# EasyEDA Pro project ProPrj_STM32F103ZET6_2025-04-15.epro, schematic Schematic1
Board Name: Board1; Create Date: 2025-03-15; Page Name: P1; Project Name: STM32F103ZET6; Schematic Name: Schematic1; Update Date: 2025-03-17; Company: 嘉立创EDA; Page Size: A4; Version: V1.0
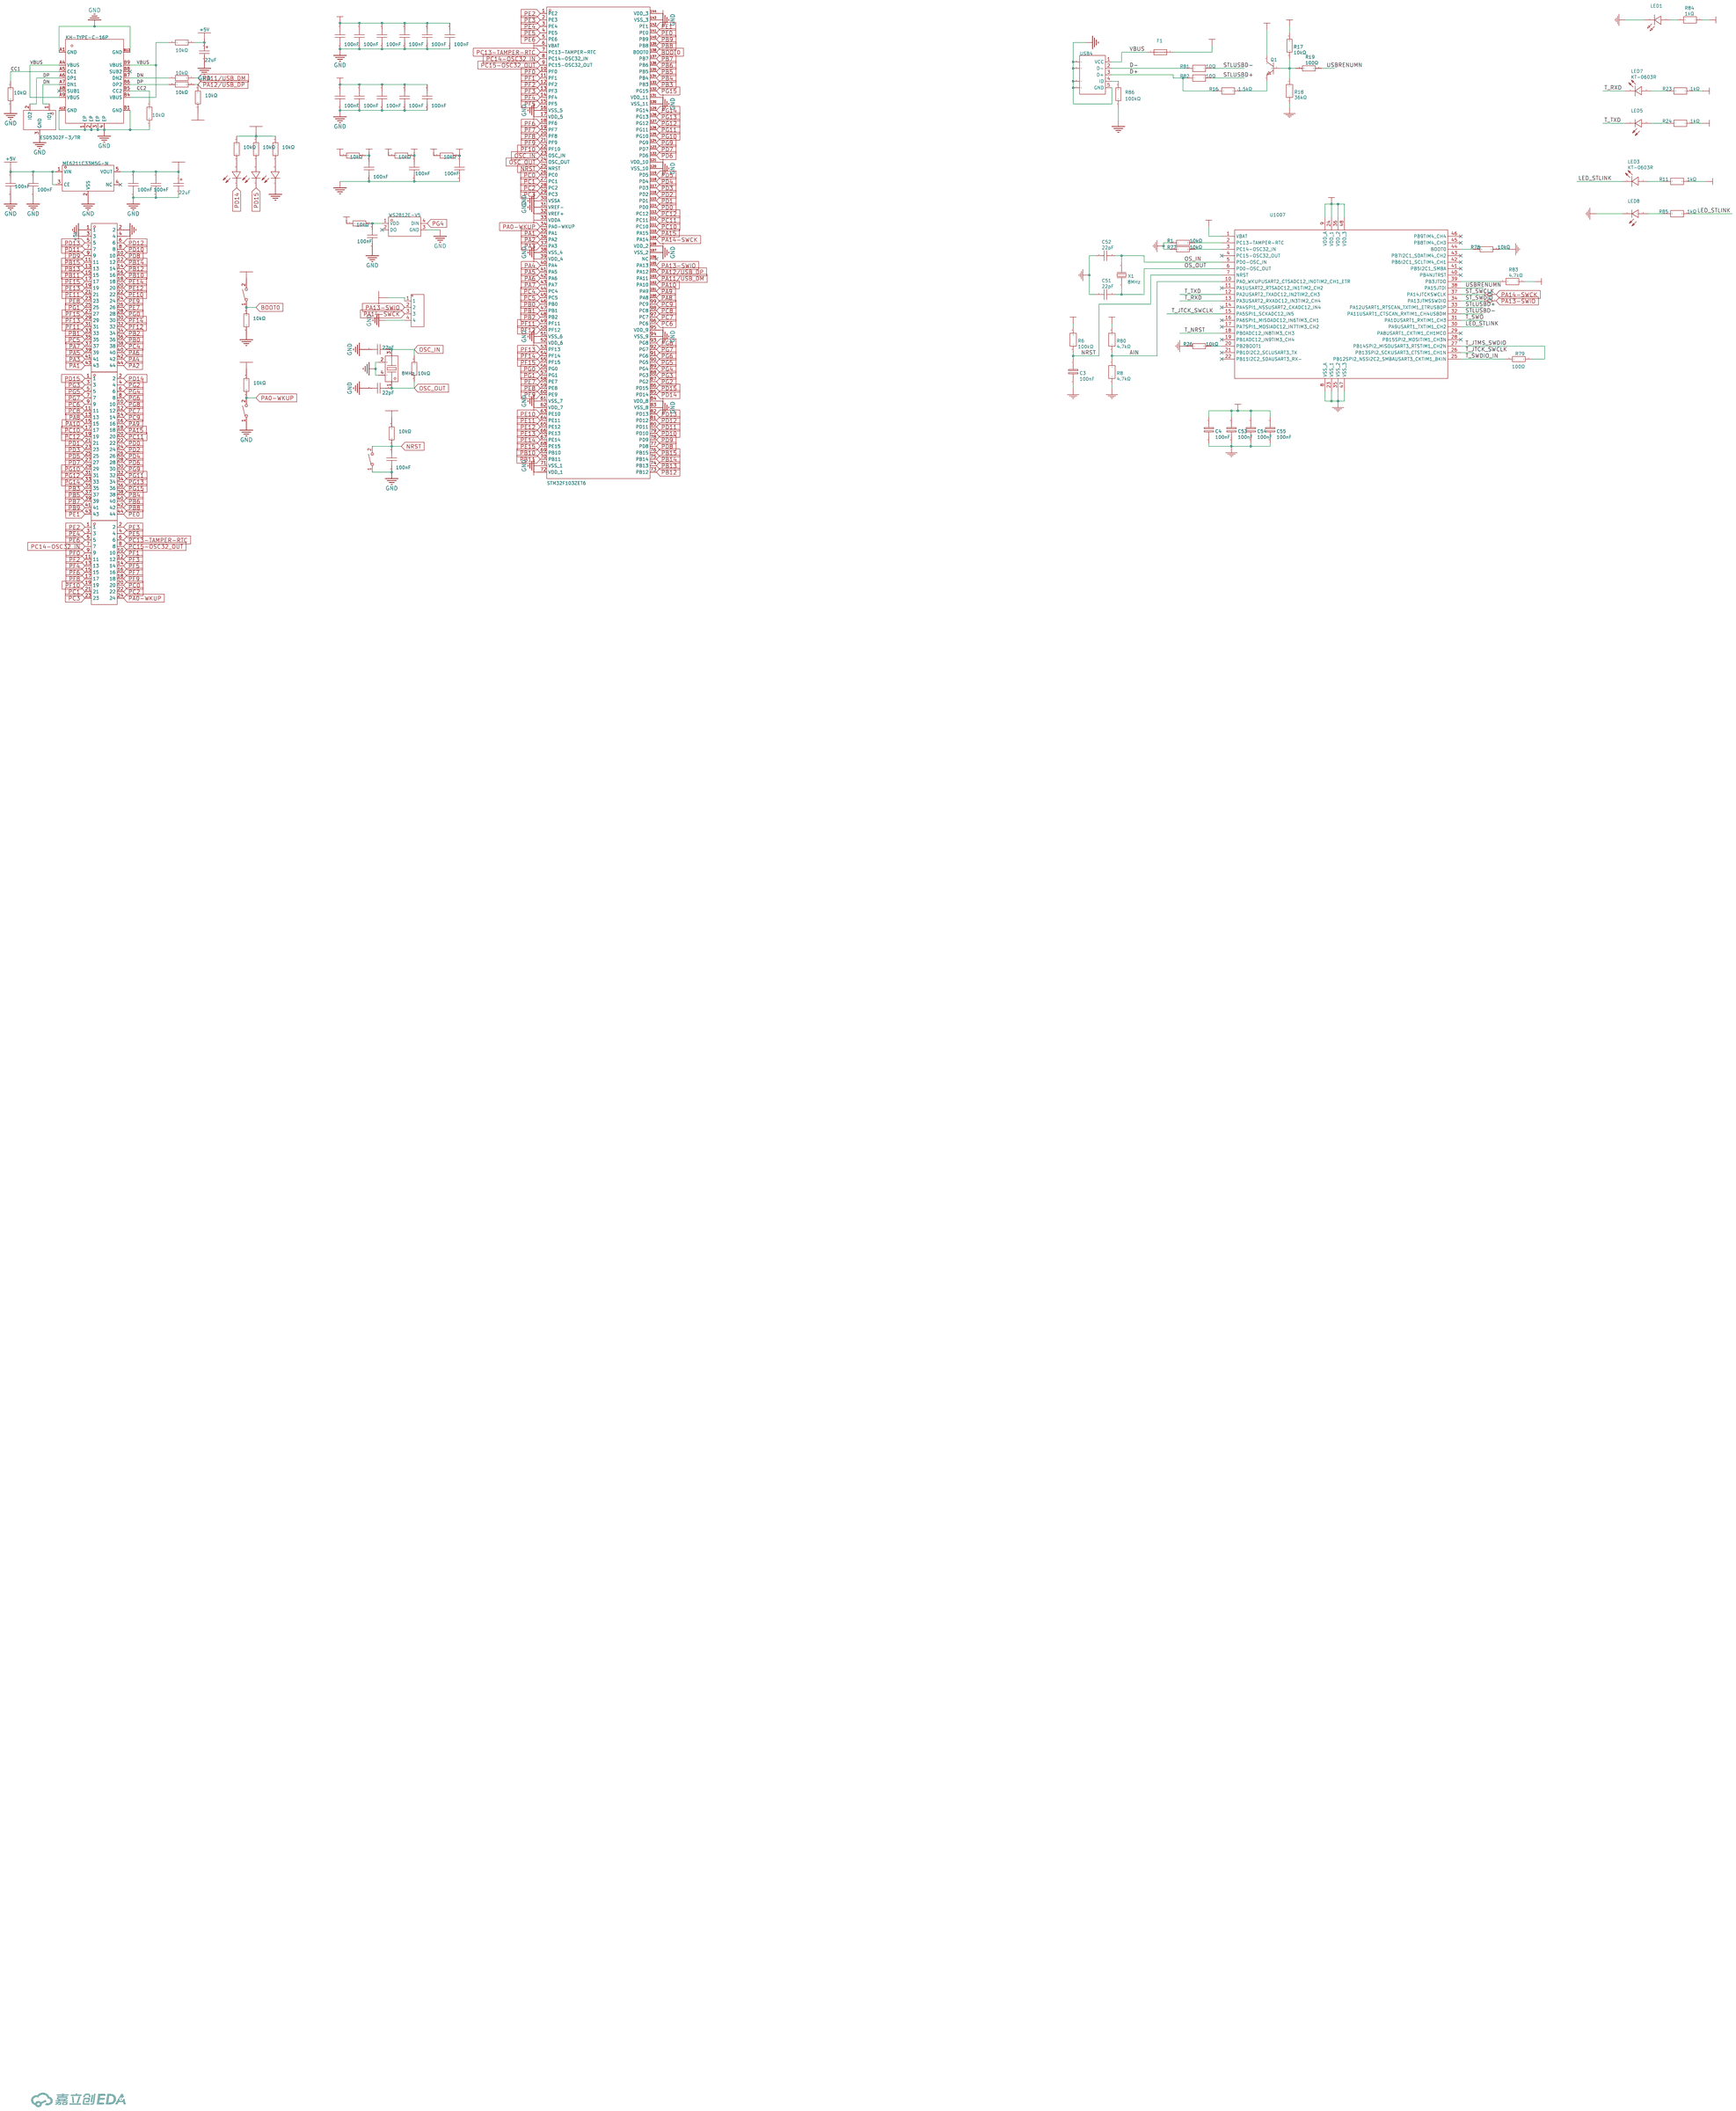
[diagram p0: schematic sheet]

## Parts
C1  22pF  [C0402]
C2  22pF  [C0402]
C3  100nF  [C0603]
C4  100nF  [C0603]
C5  100nF  [C0402]
C6  100nF  [C0402]
C7  100nF  [C0402]
C12  100nF  [C0402]
C13  100nF  [C0402]
C26  100nF  [C0402]
C27  100nF  [C0402]
C28  100nF  [C0402]
C29  100nF  [C0402]
C30  100nF  [C0402]
C31  100nF  [C0402]
C32  100nF  [C0402]
C33  100nF  [C0402]
C39  100nF  [C0402]
C42  22uF  [CASE-A_3216]
C43  22uF  [CASE-A_3216]
C44  100nF  [C0402]
C45  100nF  [C0402]
C46  100nF  [C0402]
C47  100nF  [C0402]
C48  100nF  [C0402]
C50  100nF  [C0402]
C51  22pF  [C0603]
C52  22pF  [C0603]
C53  100nF  [C0603]
C54  100nF  [C0603]
C55  100nF  [C0603]
D1  ESD5302F-3/TR  [SOT-23-3_L2.9-W1.3-P1.90-LS2.4-BR]
F1  TLC-NSMD100  [F1206]
H12  PZ254V-12-24P  [HDR-TH_24P-P2.54-V-M-R2-C12-S2.54]
H13  X6521WV-2x22H-C60D30  [HDR-TH_44P-2.54-V-M-R2-C22-S2.54]
H14  X6521WV-2x22H-C60D30  [HDR-TH_44P-2.54-V-M-R2-C22-S2.54]
LDO3  ME6211C33M5G-N  [SOT-23-5_L3.0-W1.7-P0.95-LS2.8-BL]
LED1  19-217/BHC-ZL1M2RY/3T  [LED0603-FD_BLUE]
LED3  KT-0603R  [LED0603-RD]
LED4  WS2812E-V5  [LED-SMD_4P-L5.0-W5.0-LS5.4-TL-1]
LED5  NCD0603G1  [LED0603-RD_1]
LED7  KT-0603R  [LED0603-RD]
LED8  NCD0603G1  [LED0603-RD_1]
Q1  M8050  [SOT-23-3_L2.9-W1.3-P1.90-LS2.4-BR]
R1  10kΩ  [R0603]
R2  10kΩ  [R0402]
R3  10kΩ  [R0402]
R4  10kΩ  [R0402]
R5  10kΩ  [R0402]
R6  100kΩ  [R0603]
R7  10kΩ  [R0402]
R8  4.7kΩ  [R0603]
R11  1kΩ  [R0603]
R12  10kΩ  [R0402]
R13  10kΩ  [R0402]
R14  10kΩ  [R0402]
R15  10kΩ  [R0402]
R16  1.5kΩ  [R0603]
R17  10kΩ  [R0603]
R18  36kΩ  [R0603]
R19  100Ω  [R0603]
R23  1kΩ  [R0603]
R24  1kΩ  [R0603]
R26  10kΩ  [R0603]
R45  10kΩ  [R0402]
R46  10kΩ  [R0402]
R48  10kΩ  [R0402]
R63  10kΩ  [R0402]
R66  10kΩ  [R0402]
R71  10kΩ  [R0402]
R73  10kΩ  [R0402]
R76  10kΩ  [R0402]
R77  10kΩ  [R0603]
R78  10kΩ  [R0603]
R79  100Ω  [R0603]
R80  4.7kΩ  [R0603]
R81  10Ω  [R0603]
R82  10Ω  [R0603]
R83  4.7kΩ  [R0603]
R84  1kΩ  [R0603]
R85  1kΩ  [R0603]
R86  100kΩ  [R0603]
SW3  TS342A2P-WZ  [SW-SMD_L4.0-W2.9-LS5.0]
SW5  TS342A2P-WZ  [SW-SMD_L4.0-W2.9-LS5.0]
SW6  TS342A2P-WZ  [SW-SMD_L4.0-W2.9-LS5.0]
U1  -  [LED0603-RD_GREEN]
U2  -  [HDR4P]
U3  -  [LED0603-RD_GREEN]
U1004  -  [LED0603-RD_GREEN]
U1006  STM32F103ZET6  [LQFP-144_L20.0-W20.0-P0.50-LS22.0-BL]
U1007  STM32F103CBT6  [LQFP-48_L7.0-W7.0-P0.50-LS9.0-BL]
USB3  KH-TYPE-C-16P  [USB-C-SMD_KH-TYPE-C-16P]
USB4  MINI 5PTP  [MINI-USB-SMD_MINI-5PTP]
X1  8MHz  [OSC-SMD_L5.0-W3.2]
X2  8MHz  [CRYSTAL-SMD_4P-L3.2-W2.5-BL]

## Library data of the parts
C1 C2 = CC0402JRNPO9BN220: 容值:22pF;精度:±5%;额定电压:50V;材质(温度系数):NP0;; LCSC Part Name: 22pF ±5% 50V; Supplier Part: C106203; Manufacturer: YAGEO(国巨); Supplier Footprint: 0402; JLCPCB Part Class: Extended Part; Datasheet: https://atta.szlcsc.com/upload/public/pdf/source/20170505/1493957838062.pdf; Supplier: LCSC; Tolerance: ±5%; Voltage Rated: 50V; Temperature Coefficient: NP0
C3 C4 C53-C55 = AC0603KRX7R9BB104: 容值:100nF;精度:±10%;额定电压:50V;材质(温度系数):X7R;; LCSC Part Name: 100nF ±10% 50V; Supplier Part: C149620; Manufacturer: YAGEO(国巨); Supplier Footprint: 0603; JLCPCB Part Class: Extended Part; Datasheet: https://atta.szlcsc.com/upload/public/pdf/source/20180620/C149620_02F8B13B41E85E9B7C614DEEBBCCF362.pdf; Supplier: LCSC; Tolerance: ±10%; Voltage Rated: 50V; Temperature Coefficient: X7R
C5-C7 C12 C13 C28-C33 C39 C44-C48 C50 = GRM155R71H104KE14D: 容值:100nF;精度:±10%;额定电压:50V;材质(温度系数):X7R;; LCSC Part Name: 100nF ±10% 50V; Supplier Part: C77020; Manufacturer: muRata(村田); Supplier Footprint: 0402; JLCPCB Part Class: Extended Part; Datasheet: https://atta.szlcsc.com/upload/public/pdf/source/20180326/C77020_39BD49C951FF1AF0DB1F1FAC5AC1E401.pdf; Supplier: LCSC; Tolerance: ±10%; Voltage Rated: 50V; Temperature Coefficient: X7R
C26 C27 = GCM155R71C104KA55J: 容值:100nF;精度:±10%;额定电压:16V;材质(温度系数):X7R;; LCSC Part Name: 100nF ±10% 16V; Supplier Part: C2655418; Manufacturer: muRata(村田); Supplier Footprint: 0402; JLCPCB Part Class: Extended Part; Datasheet: https://atta.szlcsc.com/upload/public/pdf/source/20210701/42090801FDE37D0E45AFF657247F4A08.pdf; Supplier: LCSC; Tolerance: ±10%; Voltage Rated: 16V; Temperature Coefficient: X7R
C42 C43 = TAJA226K010RNJ: 容值:22uF;精度:±10%;额定电压:10V;等效串联电阻:3Ω@100kHz;; LCSC Part Name: 22uF ±10% 10V; Supplier Part: C11366; Manufacturer: Kyocera AVX; Supplier Footprint: CASE-A-3216; JLCPCB Part Class: 扩展库; Datasheet: https://atta.szlcsc.com/upload/public/pdf/source/20160107/1457707750344.pdf; Supplier: LCSC; Tolerance: ±10%; Rated Voltage: 10V; Equivalent Series Resistance(ESR): 3Ω@100kHz; Operating Temperature: -55℃~+125℃
C51 C52 = CL10C220JB8NNNC: 容值:22pF;精度:±5%;额定电压:50V;材质(温度系数):C0G;; LCSC Part Name: 22pF ±5% 50V; Supplier Part: C1653; Manufacturer: SAMSUNG(三星); Supplier Footprint: 0603; JLCPCB Part Class: Basic Part; Datasheet: https://atta.szlcsc.com/upload/public/pdf/source/20160218/1457707763339.pdf; Supplier: LCSC; Tolerance: ±5%; Voltage Rated: 50V; Temperature Coefficient: C0G
D1 = ESD5302F-3/TR: 反向截止电压(Vrwm):5V;钳位电压:20V;峰值脉冲电流(Ipp):16A;击穿电压:7V;; Supplier Part: C239643; Manufacturer: WILLSEMI(韦尔); Supplier Footprint: SOT-23; JLCPCB Part Class: Extended Part; Datasheet: https://atta.szlcsc.com/upload/public/pdf/source/20191209/C239643_5B865DE0A7A05DEAA50437ED66DC6932.pdf; Supplier: LCSC; Polarity: 单向; Reverse Stand-Off Voltage (Vrwm): 5V; Breakdown Voltage (Min): 7V; Peak Pulse Current (Ipp)@10/1000μs: 16A; Maximum Clamping Voltage: 20V; Clamping Voltage: 20V; Peak Pulse Current (Ipp): 16A; Voltage - Breakdown: 7V; Type: TVS
F1 = TLC-NSMD100: 耐压:6V;最大电流:100A;保持电流(Ih):1A;跳闸电流:2A;; LCSC Part Name: 6V 1A 1206自恢复; Supplier Part: C261954; Manufacturer: TLC(竞沃); Supplier Footprint: 1206; JLCPCB Part Class: Extended Part; Datasheet: https://atta.szlcsc.com/upload/public/pdf/source/20180802/C261957_E25258C63D2572D4B5DAC4246B729F01.pdf; Supplier: LCSC; Voltage - Max: 6V; Current - Max: 100A; Hold Current: 1A; Trip Current: 2A; Power Dissipation: 600mW; Time to Trip(Max): 100ms; Operating Temperature: -40℃~+85℃
H12 = PZ254V-12-24P: 插针结构:2x12P;间距:2.54mm;行距:2.54mm;圆针/方针:方针;安装类型:直插;排数:双排;总PIN位数:24P;额定电流:-;额定电压:-;配合针长度:6mm;塑高:2.5mm;端接针长度:3mm;触头材质:黄铜;触头镀层:-;工作温度范围:-40℃~+105℃;颜色:黑色;; LCSC Part Name: 间距:2.54mm 2x12P 直插 方针; Supplier Part: C492429; Manufacturer: XFCN(兴飞); Supplier Footprint: 插件,P=2.54mm; JLCPCB Part Class: 扩展库; Datasheet: https://atta.szlcsc.com/upload/public/pdf/source/20200309/C492429_A90DEF30FD4D9CDC2C3DDFC5EAF9C00B.pdf; Supplier: LCSC; Pin Structure: 2x12P; Pitch: 2.54mm; Row Spacing: 2.54mm; Circluar Pins/Square Pins: 方针; Mounting Type: 直插; Number of Rows: 双排; Number of Pins: 24P; Length of Mating Pin: 6mm; Insulation Height: 2.5mm; Length of End Connection Pin: 3mm; Contact Material: 黄铜; Operating Temperature Range: -40℃~+105℃; Color: 黑色
H13 H14 = X6521WV-2x22H-C60D30: 插针结构:2x22P;间距:2.54mm;行距:2.54mm;圆针/方针:方针;安装类型:-;排数:双排;总PIN位数:44P;额定电流:3A;额定电压:250V;配合针长度:6mm;塑高:2.5mm;端接针长度:3mm;触头材质:黄铜;触头镀层:金;工作温度范围:-40℃~+105℃;焊接温度(最大值):260℃;颜色:黑色;; LCSC Part Name: 2x22P 间距:2.54mm 方针; Supplier Part: C725894; Manufacturer: XKB Connection(中国星坤); Supplier Footprint: 插件,P=2.54mm; JLCPCB Part Class: 扩展库; Datasheet: https://atta.szlcsc.com/upload/public/pdf/source/20230515/3562B41AC32B1731F21EFD73DC35CC6C.pdf; Supplier: LCSC; Pin Structure: 2x22P; Pitch: 2.54mm; Row Spacing: 2.54mm; Circluar Pins/Square Pins: 方针; Number of Rows: 双排; Number of Pins: 44P; Current Rating (Max): 3A; Voltage Rating (Max): 250V; Length of Mating Pin: 6mm; Insulation Height: 2.5mm; Length of End Connection Pin: 3mm; Contact Material: 黄铜; Contact Plating: 金; Operating Temperature Range: -40℃~+105℃; Soldering Temperature(Max): 260℃; Color: 黑色
LDO3 = ME6211C33M5G-N: 输出类型:固定;工作电压:6V;输出电压:3.3V;输出电流:500mA;电源纹波抑制比(PSRR):70dB@(1kHz)；62dB@(10kHz);输出极性:正极;; LCSC Part Name: 输入6V 输出3.3V 500mA; Supplier Part: C82942; Manufacturer: MICRONE(南京微盟); Supplier Footprint: SOT-23-5; JLCPCB Part Class: Extended Part; Datasheet: https://atta.szlcsc.com/upload/public/pdf/source/20170918/C82942_1505727073070976520.pdf; Supplier: LCSC; Output Type: 固定; Voltage - Supply: 6V; Output Voltage: 3.3V; Output Current: 500mA; Power Supply Rejection Ratio (PSRR): 70dB@(1kHz)；62dB@(10kHz); Voltage Dropout: 260mV@(200mA); Features: 短路保护(SCP)；低ESR；过流保护(OCP)；带使能; Output Configuration: 正极; Number of Outputs: 1
LED1 = 19-217/BHC-ZL1M2RY/3T: 发光颜色:蓝色;功率:110mW;正向电流:5mA;主波长:465nm~475nm;二极管配置:-;透镜颜色:无色透明透镜;色温:-;发光角度:120°;载带方式:-;工作温度:-40℃~+85℃;; LCSC Part Name: 蓝灯 停产; Supplier Part: C72041; Manufacturer: EVERLIGHT(亿光); Supplier Footprint: 0603; JLCPCB Part Class: Extended Part; Datasheet: https://atta.szlcsc.com/upload/public/pdf/source/20170116/1484561237273.pdf; Supplier: LCSC; Emitted Color: 蓝色; Power Dissipation: 110mW; Forward Current: 5mA; Dominant Wavelength: 465nm~475nm; Peak Wavelength: 468nm; Lens Color: 无色透明透镜; Viewing Angle: 120°; Operating Temperature: -40℃~+85℃
LED3 LED7 = KT-0603R: Supplier: LCSC; Manufacturer: KENTO; Supplier Part: C2286; JLCPCB Part Class: Basic Part
LED4 = WS2812E-V5: 发光颜色:RGB三色;二极管配置:-;透镜颜色:-;主波长:623nm；451nm；523nm;峰值波长:-;色温:-;测试电流:12.5mA;功率:-;发光角度:-;安装方式:-;工作温度:-;; LCSC Part Name: RGB三色623nm451nm523nm（注意防潮，请查阅规格书中对应具体内容）; Supplier Part: C2920042; Manufacturer: worldsemi; Supplier Footprint: SMD5050; JLCPCB Part Class: 扩展库; Datasheet: https://atta.szlcsc.com/upload/public/pdf/source/20211117/0464A411C41E6FA3BF6C3A8020ED01CE.pdf; Supplier: LCSC; Emitted Color: RGB三色; Dominant Wavelength: 623nm；451nm；523nm; Forward Current: 12.5mA
LED5 LED8 = NCD0603G1: 发光颜色:翠绿色;正向电压(VF):2.6V~3.6V;功率:72mW;正向电流:10mA;主波长:515nm~530nm;透镜颜色:无色透明透镜;发光强度:330mcd~900mcd;发光角度:130°;工作温度:-30℃~+85℃;; Supplier Part: C84267; Manufacturer: 国星光电; Supplier Footprint: 0603; JLCPCB Part Class: Extended Part; Datasheet: https://atta.szlcsc.com/upload/public/pdf/source/20200820/C84267_04BA7703640BAC111D09F5EFB971FBF3.pdf; Supplier: LCSC; Emitted Color: 翠绿色; Forward Voltage (VF): 2.6V~3.6V; Power Dissipation: 72mW; Forward Current: 10mA; Dominant Wavelength: 515nm~530nm; Lens Color: 无色透明透镜; Luminous Intensity: 330mcd~900mcd; Viewing Angle: 130°; Operating Temperature: -30℃~+85℃
Q1 = M8050_C266599: 晶体管类型:NPN;集电极电流(Ic):800mA;集射极击穿电压(Vceo):25V;耗散功率(Pd):200mW;直流电流增益(hFE):45@5mA,1V;; Supplier Part: C266599; Manufacturer: BORN(伯恩半导体); Supplier Footprint: SOT-23; JLCPCB Part Class: Extended Part; Datasheet: https://atta.szlcsc.com/upload/public/pdf/source/20190325/C266599_C3D99E625B293D75672D2862955AF640.pdf; Supplier: LCSC; type: NPN; Current - Collector(Ic): 800mA; Collector - Emitter Voltage VCEO: 25V; Pd - Power Dissipation: 200mW; DC Current Gain: 45@5mA,1V; Transition frequency(fT): 150MHz; Current - Collector Cutoff: 100nA; Vce Saturation(VCE(sat)): 500mV; Operating Temperature: -55℃~+150℃
R1 R17 R26 R77 R78 = AC0603FR-0710KL: 电阻类型:厚膜电阻;阻值:10kΩ;精度:±1%;功率:100mW;最大工作电压:75V;温度系数:±100ppm/℃;; LCSC Part Name: 厚膜电阻 10kΩ ±1% 100mW; Supplier Part: C116677; Manufacturer: YAGEO(国巨); Supplier Footprint: 0603; JLCPCB Part Class: Extended Part; Datasheet: https://atta.szlcsc.com/upload/public/pdf/source/20180927/C229861_4ABDC471507C1ED6AFB4BA66AFC8620A.pdf; Supplier: LCSC; Type: 厚膜电阻; Tolerance: ±1%; Power(Watts): 100mW; Overload Voltage (Max): 75V; Temperature Coefficient: ±100ppm/℃; Operating Temperature Range: -55℃~+155℃
R2-R5 R7 R12-R15 R45 R46 R48 R63 R66 R71 R73 R76 = RC0402FR-0710KL: 电阻类型:厚膜电阻;阻值:10kΩ;精度:±1%;功率:62.5mW;最大工作电压:50V;温度系数:±100ppm/℃;; LCSC Part Name: 厚膜电阻 10kΩ ±1% 62.5mW; Supplier Part: C60490; Manufacturer: YAGEO(国巨); Supplier Footprint: 0402; JLCPCB Part Class: Extended Part; Datasheet: https://atta.szlcsc.com/upload/public/pdf/source/20170925/C131467_1506321478108990263.pdf; Supplier: LCSC; Type: 厚膜电阻; Tolerance: ±1%; Power(Watts): 62.5mW; Overload Voltage (Max): 50V; Temperature Coefficient: ±100ppm/℃; Operating Temperature Range: -55℃~+155℃
R6 = AC0603FR-07100KL: 电阻类型:厚膜电阻;阻值:100kΩ;精度:±1%;功率:100mW;最大工作电压:75V;温度系数:±100ppm/℃;; LCSC Part Name: 厚膜电阻 100kΩ ±1% 100mW; Supplier Part: C116674; Manufacturer: YAGEO(国巨); Supplier Footprint: 0603; JLCPCB Part Class: Extended Part; Datasheet: https://atta.szlcsc.com/upload/public/pdf/source/20180927/C229861_4ABDC471507C1ED6AFB4BA66AFC8620A.pdf; Supplier: LCSC; Type: 厚膜电阻; Tolerance: ±1%; Power(Watts): 100mW; Overload Voltage (Max): 75V; Temperature Coefficient: ±100ppm/℃; Operating Temperature Range: -55℃~+155℃
R8 R80 R83 = AC0603FR-074K7L: 电阻类型:厚膜电阻;阻值:4.7kΩ;精度:±1%;功率:100mW;最大工作电压:75V;温度系数:±100ppm/℃;; LCSC Part Name: 厚膜电阻 4.7kΩ ±1% 100mW; Supplier Part: C116697; Manufacturer: YAGEO(国巨); Supplier Footprint: 0603; JLCPCB Part Class: Extended Part; Datasheet: https://atta.szlcsc.com/upload/public/pdf/source/20180927/C229861_4ABDC471507C1ED6AFB4BA66AFC8620A.pdf; Supplier: LCSC; Type: 厚膜电阻; Tolerance: ±1%; Power(Watts): 100mW; Overload Voltage (Max): 75V; Temperature Coefficient: ±100ppm/℃; Operating Temperature Range: -55℃~+155℃
R11 R23 R24 R84 R85 = RC0603FR-071KL: 电阻类型:厚膜电阻;阻值:1kΩ;精度:±1%;功率:100mW;最大工作电压:75V;温度系数:±100ppm/℃;; LCSC Part Name: 厚膜电阻 1kΩ ±1% 100mW; Supplier Part: C22548; Manufacturer: YAGEO(国巨); Supplier Footprint: 0603; JLCPCB Part Class: Extended Part; Datasheet: https://atta.szlcsc.com/upload/public/pdf/source/20180316/70C0E2BDAE7FCC62C531A5A58D202EE1.pdf; Supplier: LCSC; Type: 厚膜电阻; Tolerance: ±1%; Power(Watts): 100mW; Overload Voltage (Max): 75V; Temperature Coefficient: ±100ppm/℃; Operating Temperature Range: -55℃~+155℃
R16 = RC0603FR-071K5L: 电阻类型:厚膜电阻;阻值:1.5kΩ;精度:±1%;功率:100mW;最大工作电压:75V;温度系数:±100ppm/℃;; LCSC Part Name: 厚膜电阻 1.5kΩ ±1% 100mW; Supplier Part: C114668; Manufacturer: YAGEO(国巨); Supplier Footprint: 0603; JLCPCB Part Class: Extended Part; Datasheet: https://atta.szlcsc.com/upload/public/pdf/source/20180821/C275644_0D56F95EFF785E7D9A1FEF436B37DA78.pdf; Supplier: LCSC; Type: 厚膜电阻; Tolerance: ±1%; Power(Watts): 100mW; Overload Voltage (Max): 75V; Temperature Coefficient: ±100ppm/℃; Operating Temperature Range: -55℃~+155℃
R18 = AC0603FR-0736KL: 电阻类型:厚膜电阻;阻值:36kΩ;精度:±1%;功率:100mW;最大工作电压:75V;温度系数:±100ppm/℃;; LCSC Part Name: 厚膜电阻 36kΩ ±1% 100mW; Supplier Part: C227841; Manufacturer: YAGEO(国巨); Supplier Footprint: 0603; JLCPCB Part Class: Extended Part; Datasheet: https://atta.szlcsc.com/upload/public/pdf/source/20181022/C227841_96856283ED360952E7A28642F53DDE64.pdf; Supplier: LCSC; Type: 厚膜电阻; Tolerance: ±1%; Power(Watts): 100mW; Overload Voltage (Max): 75V; Temperature Coefficient: ±100ppm/℃; Operating Temperature Range: -55℃~+155℃
R19 R79 = RC0603FR-07100RL: 电阻类型:厚膜电阻;阻值:100Ω;精度:±1%;功率:100mW;最大工作电压:75V;温度系数:±100ppm/℃;; LCSC Part Name: 厚膜电阻 100Ω ±1% 100mW; Supplier Part: C105588; Manufacturer: YAGEO(国巨); Supplier Footprint: 0603; JLCPCB Part Class: Extended Part; Datasheet: https://atta.szlcsc.com/upload/public/pdf/source/20180316/70C0E2BDAE7FCC62C531A5A58D202EE1.pdf; Supplier: LCSC; Type: 厚膜电阻; Tolerance: ±1%; Power(Watts): 100mW; Overload Voltage (Max): 75V; Temperature Coefficient: ±100ppm/℃; Operating Temperature Range: -55℃~+155℃
R81 R82 = RC0603FR-0710RL: 电阻类型:厚膜电阻;阻值:10Ω;精度:±1%;功率:100mW;最大工作电压:75V;温度系数:±200ppm/℃;; LCSC Part Name: 厚膜电阻 10Ω ±1% 100mW; Supplier Part: C109318; Manufacturer: YAGEO(国巨); Supplier Footprint: 0603; JLCPCB Part Class: Extended Part; Datasheet: https://atta.szlcsc.com/upload/public/pdf/source/20180316/70C0E2BDAE7FCC62C531A5A58D202EE1.pdf; Supplier: LCSC; Type: 厚膜电阻; Tolerance: ±1%; Power(Watts): 100mW; Overload Voltage (Max): 75V; Temperature Coefficient: ±200ppm/℃; Operating Temperature Range: -55℃~+155℃
R86 = 0603WAF1003T5E: 电阻类型:厚膜电阻;阻值:100kΩ;精度:±1%;功率:100mW;最大工作电压:75V;温度系数:±100ppm/℃;; LCSC Part Name: 100kΩ ±1% 100mW 厚膜电阻; Supplier Part: C25803; Manufacturer: UNI-ROYAL(厚声); Supplier Footprint: 0603; JLCPCB Part Class: 基础库; Datasheet: https://atta.szlcsc.com/upload/public/pdf/source/20200306/C422600_1E6D84923E4A46A82E41ADD87F860B5C.pdf; Supplier: LCSC; Type: 厚膜电阻; Tolerance: ±1%; Power(Watts): 100mW; Overload Voltage (Max): 75V; Temperature Coefficient: ±100ppm/℃; Operating Temperature Range: -55℃~+155℃
SW3 SW5 SW6 = TS342A2P-WZ: 电路结构:单刀单掷;按钮形状:圆形按钮;安装方式:立贴;开关长度:3.95mm;开关宽度:2.9mm;开关高度:2mm;带支架:不带;触点电流:50mA;额定电压(DC):12V;绝缘电阻:100MΩ;机械寿命:3万次;; LCSC Part Name: 3.95*2.9*2mm 立贴 轻触开关; Supplier Part: C557591; Manufacturer: SHOU HAN(首韩); Supplier Footprint: SMD; JLCPCB Part Class: Extended Part; Datasheet: https://atta.szlcsc.com/upload/public/pdf/source/20200519/C557591_B3A5A21584733303F06306F18577DA8B.pdf; Supplier: LCSC; Contact Current: 50mA; Voltage Rating (DC): 12V; Insulation Resistance: 100MΩ; Circuit: 单刀单掷; Mounting Style: 立贴; Actuator Style: 圆形按钮; Actuator/Cap Color: 黑色; Mechanical Life: 3万次; Operating Temperature: -25℃~+70℃; Pin Style: SMD接片; Switch Length: 3.95mm; Switch Width: 2.9mm; Switch Height: 2mm; Strike Gundam: 不带
U1 U3 U1004 = 绿色LED0603: Supplier Part: C9900005570; Supplier Footprint: LED0603; JLCPCB Part Class: ExtendedPart; Supplier: LCSC
U2 = HDR4P
U1006 = STM32F103ZET6: CPU内核:ARM-M3;CPU最大主频:72MHz;; LCSC Part Name: 主流增强型ARM Cortex-M3 MCU，具有512 KB Flash、72 MHz CPU、电机控制、USB和CAN; Supplier Part: C8287; Manufacturer: ST(意法半导体); Supplier Footprint: LQFP-144(20x20); JLCPCB Part Class: 扩展库; Datasheet: https://atta.szlcsc.com/upload/public/pdf/source/20180327/C88435_0E51D69B5FFD7B1A3F36EB9FC047A4C2.pdf; Supplier: LCSC; CPU Core: ARM-M3; CPU Maximum Speed: 72MHz; Program Storage Size: 512KB; Program Memory Type: FLASH; Number of I/O: 112; ADC (Bit): 12bit; DAC (Bit): 12bit; Low Voltage Detection Threshold: 2V~3.6V; RAM Size: 64KB; GPIO Ports Number: 112; Operating Voltage Range: 2V~3.6V; Operating Temperature Range: -40℃~+85℃; Universal Serial Bus: 有; Peripheral/Function: DMA；片载温度传感器；PWM; Watchdog: 有; Infrared Data Association: 有; Low-Voltage Detect: 有; Direct Memory Access: 有; Internal Oscillator: 有
U1007 = STM32F103CBT6: CPU内核:ARM-M3;CPU最大主频:72MHz;应用领域:-;; LCSC Part Name: 主流增强型ARM Cortex-M3 MCU，具有128 KB Flash、72 MHz CPU、电机控制、USB和CAN; Supplier Part: C8304; Manufacturer: ST(意法半导体); Supplier Footprint: LQFP-48(7x7); JLCPCB Part Class: Extended Part; Datasheet: https://atta.szlcsc.com/upload/public/pdf/source/20150811/1457707344439.pdf; Supplier: LCSC; CPU Core: ARM-M3; CPU Maximum Speed: 72MHz; Program Storage Size: 128KB; Program Memory Type: FLASH; Number of I/O: 37; ADC (Bit): 12bit; Low Voltage Detection Threshold: 2V~3.6V
USB3 = KH-TYPE-C-16P: 连接器类型:Type-C;标准:-;公母:母座;触点数量:16;端口数量:1;安装方式:卧贴;额定电流 - 电源:3A;工作温度范围:-40℃~+85℃;; LCSC Part Name: Type-C母座卧贴; Supplier Part: C709357; Manufacturer: kinghelm(金航标); Supplier Footprint: SMD; JLCPCB Part Class: 扩展库; Datasheet: https://atta.szlcsc.com/upload/public/pdf/source/20200911/C709357_AA8DCEB38BB20E3035A7ED7AE7667837.pdf; Supplier: LCSC; Connector Type: Type-C; Gender: 母座; Number of Contacts: 16; Number of Ports: 1; Mounting Style: 卧贴; Current Rating - Power (Max): 3A; Operating Temperature Range: -40℃~+85℃
USB4 = MINI 5PTP: 连接器类型:Mini-B;标准:USB 2.0;公母:母;安装方式:卧贴;触点数量:5P;端口数量:1;额定电流 - 电源:1A;工作温度范围:-30℃~+80℃;; Supplier Part: C2681563; Manufacturer: SHOU HAN(首韩); Supplier Footprint: SMD; JLCPCB Part Class: 扩展库; Datasheet: https://atta.szlcsc.com/upload/public/pdf/source/20210122/C2681563_5D04D24BBA4C56EC4906A22CA4EB95CA.pdf; Supplier: LCSC; Connector Type: Mini-B; Standard: USB 2.0; Gender: 母; Mounting Style: 卧贴; Number of Contacts: 5P; Number of Ports: 1; Current Rating - Power (Max): 1A; Rated Voltage (Max): 30V; Connect-Disconnect Life: 3千次; Length: 9.3mm; Core Colour: 黑色; Operating Temperature Range: -30℃~+80℃
X1 = 7A08000008: 晶振类型:贴片晶振;频率:8MHz;常温频差:±30ppm;负载电容:20pF;; LCSC Part Name: 8MHz ±30ppm 20pF; Supplier Part: C111120; Manufacturer: TXC(晶技); Supplier Footprint: SMD5032; JLCPCB Part Class: Extended Part; Datasheet: https://atta.szlcsc.com/upload/public/pdf/source/20170624/1498276323594.pdf; Supplier: LCSC; Crystal Type: 贴片晶振; Normal temperature Frequency Tolerance: ±30ppm; Load Capacitance: 20pF; Equivalent Series Resistance (ESR): 80Ω; Operating Temperature: -10℃~+70℃
X2 = CJ13-080001210B20: 频率:8MHz;常温频差:±10ppm;负载电容:12pF;; LCSC Part Name: 8MHz ±10ppm 12pF; Supplier Part: C2875274; Manufacturer: CJ(江苏长电/长晶); Supplier Footprint: SMD3225-4P; JLCPCB Part Class: Extended Part; Datasheet: https://atta.szlcsc.com/upload/public/pdf/source/20210824/6E1F59D92CEEC2B7E10E0FA064B9C05B.pdf; Supplier: LCSC; Normal temperature Frequency Tolerance: ±10ppm; Load Capacitance: 12pF

## Nets
+3.3V: C4.1 C5.1 C6.1 C7.1 C12.1 C27.1 C28.1 C33.1 C43.1 C44.1 C45.1 C46.1 C47.1 C48.1 C50.1 C53.1 C54.1 C55.1 H14.4 LDO3.5(VOUT) Q1.3(C) R3.2 R4.2 R5.2 R6.2 R11.1 R23.1 R24.1 R45.2 R46.1 R66.2 R71.2 R73.1 R76.1 R80.2 R83.1 R84.1 SW6.2 U2.1 U1006.17(VDD_5) U1006.39(VDD_4) U1006.52(VDD_6) U1006.62(VDD_7) U1006.72(VDD_1) U1006.84(VDD_8) U1006.95(VDD_9) U1006.108(VDD_2) U1006.121(VDD_10) U1006.131(VDD_11) U1006.144(VDD_3) U1007.1(VBAT) U1007.9(VDD_A) U1007.24(VDD_1) U1007.36(VDD_2) U1007.48(VDD_3)
+5V: C26.1 C29.1 C42.1 F1.2 H14.3 LDO3.1(VIN) LDO3.3(CE) R17.2 R63.1
GND: C1.2 C2.1 C3.2 C4.2 C5.2 C6.2 C7.2 C12.2 C13.2 C26.2 C27.2 C28.2 C29.2 C30.2 C31.2 C32.2 C33.2 C39.2 C42.2 C43.2 C44.2 C45.2 C46.2 C47.2 C48.2 C50.2 C51.1 C52.1 C53.2 C54.2 C55.2 D1.3(GND) H14.1 H14.2 LDO3.2(VSS) LED1.2 LED4.3(GND) LED8.1(K) R1.1 R8.1 R12.2 R13.2 R18.1 R26.1 R48.1 R77.1 R78.2 R86.1 SW3.1 SW5.1 U1.1(-) U2.4 U1006.16(VSS_5) U1006.30(VSSA) U1006.31(VREF-) U1006.38(VSS_4) U1006.51(VSS_6) U1006.61(VSS_7) U1006.71(VSS_1) U1006.83(VSS_8) U1006.94(VSS_9) U1006.107(VSS_2) U1006.120(VSS_10) U1006.130(VSS_11) U1006.143(VSS_3) U1007.8(VSS_A) U1007.23(VSS_1) U1007.35(VSS_2) U1007.47(VSS_3) USB3.1(EP) USB3.2(EP) USB3.3(EP) USB3.4(EP) USB3.A1(GND) USB3.A12(GND) USB3.B1(GND) USB3.B12(GND) USB4.5(GND) USB4.6(EH) USB4.7(EH) USB4.8(EH) USB4.9(EH) X2.2(GND) X2.4(GND)
VBAT: C30.1 R45.1 U1006.6(VBAT)
VBUS: F1.1 R2.1 R63.2 USB3.A4(VBUS) USB3.A9(VBUS) USB3.B4(VBUS) USB3.B9(VBUS) USB4.1(VCC)
VDDA: C31.1 R46.2 U1006.33(VDDA)
AIN: R8.2 R80.1 U1007.10(PA0_WKUPUSART2_CTSADC12_IN0TIM2_CH1_ETR)
BOOT0: R48.2 SW6.1 U1006.138(BOOT0)
CC1: R13.1 USB3.A5(CC1)
CC2: R12.1 USB3.B5(CC2)
D+: R16.1 R82.1 USB4.3(D+)
D-: R81.1 USB4.2(D-)
DN: D1.1(IO1) R14.1 USB3.A7(DN1) USB3.B7(DN2)
DP: D1.2(IO2) R15.1 USB3.A6(DP1) USB3.B6(DP2)
LED_STLINK: LED3.1(K) R85.1 U1007.30(PA9USART1_TXTIM1_CH2)
NRST: C3.1 C13.1 R5.1 R6.1 SW3.2 U1006.25(NRST) U1007.7(NRST)
OS_IN: C52.2 U1007.5(PD0-OSC_IN) X1.2
OS_OUT: C51.2 U1007.6(PD0-OSC_OUT) X1.1
OSC_IN: C2.2 R7.2 U1006.23(OSC_IN) X2.3
OSC_OUT: C1.1 R7.1 U1006.24(OSC_OUT) X2.1
PA0-WKUP: H12.24 R71.1 SW5.2 U1006.34(PA0-WKUP)
PA1: H14.43 U1006.35(PA1)
PA2: H14.44 U1006.36(PA2)
PA3: H14.41 U1006.37(PA3)
PA4: H14.42 U1006.40(PA4)
PA5: H14.39 U1006.41(PA5)
PA6: H14.40 U1006.42(PA6)
PA7: H14.37 U1006.43(PA7)
PA8: H13.13 U1006.100(PA8)
PA9: H13.16 U1006.101(PA9)
PA10: H13.15 U1006.102(PA10)
PA11/USB_DM: R14.2 U1006.103(PA11)
PA12/USB_DP: R2.2 R15.2 U1006.104(PA12)
PA13-SWIO: U2.2 U1006.105(PA13) U1007.34(PA13JTMSSWDIO)
PA14-SWCK: U2.3 U1006.109(PA14) U1007.37(PA14JTCKSWCLK)
PA15: H13.18 U1006.110(PA15)
PB0: H14.36 U1006.46(PB0)
PB1: H14.33 U1006.47(PB1)
PB2: H14.34 U1006.48(PB2)
PB3: H13.35 U1006.133(PB3)
PB4: H13.38 U1006.134(PB4)
PB5: H13.37 U1006.135(PB5)
PB6: H13.40 U1006.136(PB6)
PB7: H13.39 U1006.137(PB7)
PB8: H13.42 U1006.139(PB8)
PB9: H13.41 U1006.140(PB9)
PB10: H14.16 U1006.69(PB10)
PB11: H14.15 U1006.70(PB11)
PB12: H14.14 U1006.73(PB12)
PB13: H14.13 U1006.74(PB13)
PB14: H14.12 U1006.75(PB14)
PB15: H14.11 U1006.76(PB15)
PC0: H12.20 U1006.26(PC0)
PC1: H12.21 U1006.27(PC1)
PC2: H12.22 U1006.28(PC2)
PC3: H12.23 U1006.29(PC3)
PC4: H14.38 U1006.44(PC4)
PC5: H14.35 U1006.45(PC5)
PC6: H13.9 U1006.96(PC6)
PC7: H13.12 U1006.97(PC7)
PC8: H13.11 U1006.98(PC8)
PC9: H13.14 U1006.99(PC9)
PC10: H13.17 U1006.111(PC10)
PC11: H13.20 U1006.112(PC11)
PC12: H13.19 U1006.113(PC12)
PC13-TAMPER-RTC: H12.6 U1006.7(PC13-TAMPER-RTC)
PC14-OSC32_IN: H12.7 U1006.8(PC14-OSC32_IN)
PC15-OSC32_OUT: H12.8 U1006.9(PC15-OSC32_OUT)
PD0: H13.22 U1006.114(PD0)
PD1: H13.21 U1006.115(PD1)
PD2: H13.24 U1006.116(PD2)
PD3: H13.23 U1006.117(PD3)
PD4: H13.26 U1006.118(PD4)
PD5: H13.25 U1006.119(PD5)
PD6: H13.28 U1006.122(PD6)
PD7: H13.27 U1006.123(PD7)
PD8: H14.10 U1006.77(PD8)
PD9: H14.9 U1006.78(PD9)
PD10: H14.8 U1006.79(PD10)
PD11: H14.7 U1006.80(PD11)
PD12: H14.6 U1006.81(PD12)
PD13: H14.5 U1006.82(PD13)
PD14: H13.2 U1004.1(-) U1006.85(PD14)
PD15: H13.1 U3.1(-) U1006.86(PD15)
PE0: H13.44 U1006.141(PE0)
PE1: H13.43 U1006.142(PE1)
PE2: H12.1 U1006.1(PE2)
PE3: H12.2 U1006.2(PE3)
PE4: H12.3 U1006.3(PE4)
PE5: H12.4 U1006.4(PE5)
PE6: H12.5 U1006.5(PE6)
PE7: H14.26 U1006.58(PE7)
PE8: H14.23 U1006.59(PE8)
PE9: H14.24 U1006.60(PE9)
PE10: H14.22 U1006.63(PE10)
PE11: H14.21 U1006.64(PE11)
PE12: H14.20 U1006.65(PE12)
PE13: H14.19 U1006.66(PE13)
PE14: H14.18 U1006.67(PE14)
PE15: H14.17 U1006.68(PE15)
PF0: H12.9 U1006.10(PF0)
PF1: H12.10 U1006.11(PF1)
PF2: H12.11 U1006.12(PF2)
PF3: H12.12 U1006.13(PF3)
PF4: H12.13 U1006.14(PF4)
PF5: H12.14 U1006.15(PF5)
PF6: H12.15 U1006.18(PF6)
PF7: H12.16 U1006.19(PF7)
PF8: H12.17 U1006.20(PF8)
PF9: H12.18 U1006.21(PF9)
PF10: H12.19 U1006.22(PF10)
PF11: H14.31 U1006.49(PF11)
PF12: H14.32 U1006.50(PF12)
PF13: H14.29 U1006.53(PF13)
PF14: H14.30 U1006.54(PF14)
PF15: H14.27 U1006.55(PF15)
PG0: H14.28 U1006.56(PG0)
PG1: H14.25 U1006.57(PG1)
PG2: H13.4 U1006.87(PG2)
PG3: H13.3 U1006.88(PG3)
PG4: H13.6 LED4.4(DIN) U1006.89(PG4)
PG5: H13.5 U1006.90(PG5)
PG6: H13.8 U1006.91(PG6)
PG7: H13.7 U1006.92(PG7)
PG8: H13.10 U1006.93(PG8)
PG9: H13.30 U1006.124(PG9)
PG10: H13.29 U1006.125(PG10)
PG11: H13.32 U1006.126(PG11)
PG12: H13.31 U1006.127(PG12)
PG13: H13.34 U1006.128(PG13)
PG14: H13.33 U1006.129(PG14)
PG15: H13.36 U1006.132(PG15)
STLUSBD+: R82.2 U1007.33(PA12USART1_RTSCAN_TXTIM1_ETRUSBDP)
STLUSBD-: R81.2 U1007.32(PA11USART1_CTSCAN_RXTIM1_CH4USBDM)
T_JTCK_SWCLK: U1007.15(PA5SPI1_SCKADC12_IN5) U1007.26(PB13SPI2_SCKUSART3_CTSTIM1_CH1N)
T_JTMS_SWDIO: R79.1 U1007.27(PB14SPI2_MISOUSART3_RTSTIM1_CH2N)
T_NRST: U1007.18(PB0ADC12_IN8TIM3_CH3)
T_RXD: LED7.1(K) U1007.13(PA3USART2_RXADC12_IN3TIM2_CH4)
T_SWDIO_IN: R79.2 U1007.25(PB12SPI2_NSSI2C2_SMBAUSART3_CKTIM1_BKIN)
T_SWO: U1007.31(PA10USART1_RXTIM1_CH3)
T_TXD: LED5.1(K) U1007.12(PA2USART2_TXADC12_IN2TIM2_CH3)
USBRENUMN: R19.1 U1007.38(PA15JTDI)
VREF: C32.1 R73.2 U1006.32(VREF+)
$1N11988: R4.1 U3.2(+)
$1N11998: R66.1 U1004.2(+)
$1N12007: R3.1 U1.2(+)
$1N12170: C39.1 LED4.1(VDD) R76.2
$1N14474: R77.2 U1007.3(PC14-OSC32_IN)
$1N14475: R1.2 U1007.2(PC13-TAMPER-RTC)
$1N14483: R26.2 U1007.20(PB2BOOT1)
$1N14522: Q1.2(E) R16.2
$1N14524: Q1.1(B) R17.1 R18.2 R19.2
$1N14545: R83.2 U1007.39(PB3JTDO)
$1N14546: R78.1 U1007.44(BOOT0)
$1N14552: LED1.1 R84.2
$1N14560: LED8.2(A) R85.2
$1N14561: LED3.2(A) R11.2
$1N14562: LED7.2(A) R23.2
$1N14563: LED5.2(A) R24.2
$1N18116: R86.2 USB4.4(ID)

Not connected (* = marked no-connect by the designer): LDO3 4(NC)*; LED4 2(DO)*; U1006 106(NC)*; U1007 4(PC15-OSC32_OUT)* 11(PA1USART2_RTSADC12_IN1TIM2_CH2)* 14(PA4SPI1_NSSUSART2_CKADC12_IN4)* 16(PA6SPI1_MISOADC12_IN6TIM3_CH1)* 17(PA7SPI1_MOSIADC12_IN7TIM3_CH2)* 19(PB1ADC12_IN9TIM3_CH4)* 21(PB10I2C2_SCLUSART3_TX)* 22(PB11I2C2_SDAUSART3_RX-)* 28(PB15SPI2_MOSITIM1_CH3N)* 29(PA8USART1_CKTIM1_CH1MCO)* 40(PB4NJTRST)* 41(PB5I2C1_SMBA)* 42(PB6I2C1_SCLTIM4_CH1)* 43(PB7I2C1_SDATIM4_CH2)* 45(PB8TIM4_CH3)* 46(PB9TIM4_CH4)*; USB3 A8(SUB1)* B8(SUB2)*
